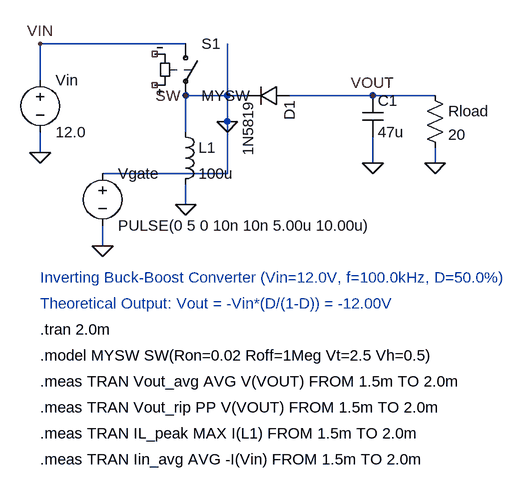
[diagram p0: schematic buck_boost.asc]
buck_boost.asc, the LTspice schematic file:
Version 4
SHEET 1 1200 800
WIRE 128 200 352 200
WIRE 128 200 128 256
WIRE 128 336 128 368
WIRE 224 400 416 400
WIRE 416 400 416 200
WIRE 224 480 224 512
WIRE 416 280 416 320
WIRE 352 280 352 336
WIRE 352 416 352 448
WIRE 352 280 448 280
WIRE 512 280 640 280
WIRE 640 344 640 384
WIRE 640 280 736 280
WIRE 736 360 736 384
FLAG 128 200 VIN
FLAG 128 368 0
FLAG 224 512 0
FLAG 416 320 0
FLAG 352 280 SW
FLAG 352 448 0
FLAG 640 384 0
FLAG 736 384 0
FLAG 640 280 VOUT
SYMBOL voltage 128 240 R0
SYMATTR InstName Vin
SYMATTR Value 12.0
SYMBOL voltage 224 384 R0
WINDOW 0 24 16 Left 2
WINDOW 3 24 96 Left 2
SYMATTR InstName Vgate
SYMATTR Value PULSE(0 5 0 10n 10n 5.00u 10.00u)
SYMBOL sw 352 184 R0
SYMATTR InstName S1
SYMATTR Value MYSW
SYMBOL ind 336 320 R0
SYMATTR InstName L1
SYMATTR Value 100u
SYMBOL diode 512 264 R90
SYMATTR InstName D1
SYMATTR Value 1N5819
SYMBOL cap 624 280 R0
SYMATTR InstName C1
SYMATTR Value 47u
SYMBOL res 720 264 R0
SYMATTR InstName Rload
SYMATTR Value 20
TEXT 128 560 Left 2 ;Inverting Buck-Boost Converter (Vin=12.0V, f=100.0kHz, D=50.0%)
TEXT 128 600 Left 2 ;Theoretical Output: Vout = -Vin*(D/(1-D)) = -12.00V
TEXT 128 640 Left 2 !.tran 2.0m
TEXT 128 680 Left 2 !.model MYSW SW(Ron=0.02 Roff=1Meg Vt=2.5 Vh=0.5)
TEXT 128 720 Left 2 !.meas TRAN Vout_avg AVG V(VOUT) FROM 1.5m TO 2.0m
TEXT 128 760 Left 2 !.meas TRAN Vout_rip PP V(VOUT) FROM 1.5m TO 2.0m
TEXT 128 800 Left 2 !.meas TRAN IL_peak MAX I(L1) FROM 1.5m TO 2.0m
TEXT 128 840 Left 2 !.meas TRAN Iin_avg AVG -I(Vin) FROM 1.5m TO 2.0m

The netlist it stands for:
* buck_boost.asc
Vin VIN 0 12.0
Vgate 0 0 PULSE(0 5 0 10n 10n 5.00u 10.00u)
S1 VIN 0 NC_01 NC_02 MYSW
L1 0 0 100u
D1 VOUT 0 1N5819
C1 VOUT 0 47u
Rload VOUT 0 20
.model D D
.lib standard.dio
* Inverting Buck-Boost Converter (Vin=12.0V, f=100.0kHz, D=50.0%)
* Theoretical Output: Vout = -Vin*(D/(1-D)) = -12.00V
.tran 2.0m
.model MYSW SW(Ron=0.02 Roff=1Meg Vt=2.5 Vh=0.5)
.meas TRAN Vout_avg AVG V(VOUT) FROM 1.5m TO 2.0m
.meas TRAN Vout_rip PP V(VOUT) FROM 1.5m TO 2.0m
.meas TRAN IL_peak MAX I(L1) FROM 1.5m TO 2.0m
.meas TRAN Iin_avg AVG -I(Vin) FROM 1.5m TO 2.0m
.backanno
.end